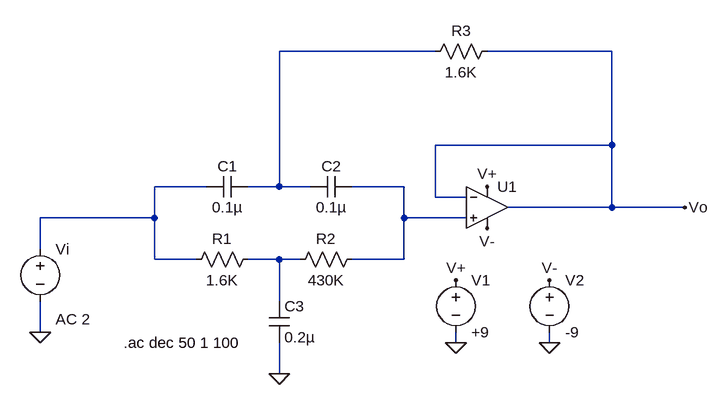
[diagram p0: schematic NOTCH.asc]
NOTCH.asc, the LTspice schematic file:
Version 4
SHEET 1 880 680
WIRE 288 -384 48 -384
WIRE 560 -384 368 -384
WIRE 560 -240 560 -384
WIRE 560 -240 288 -240
WIRE -64 -176 -144 -176
WIRE 48 -176 48 -384
WIRE 48 -176 0 -176
WIRE 96 -176 48 -176
WIRE 240 -176 160 -176
WIRE 288 -160 288 -240
WIRE 336 -160 288 -160
WIRE 560 -144 560 -240
WIRE 560 -144 400 -144
WIRE 672 -144 560 -144
WIRE -144 -128 -144 -176
WIRE -144 -128 -320 -128
WIRE 240 -128 240 -176
WIRE 336 -128 240 -128
WIRE -320 -80 -320 -128
WIRE -144 -64 -144 -128
WIRE -80 -64 -144 -64
WIRE 48 -64 0 -64
WIRE 80 -64 48 -64
WIRE 240 -64 240 -128
WIRE 240 -64 160 -64
WIRE 48 0 48 -64
WIRE -320 48 -320 0
WIRE 320 64 320 48
WIRE 464 64 464 48
WIRE 48 112 48 64
FLAG 48 112 0
FLAG -320 48 0
FLAG 320 -32 V+
FLAG 464 -32 V-
FLAG 320 64 0
FLAG 464 64 0
FLAG 368 -176 V+
FLAG 368 -112 V-
FLAG 672 -144 Vo
SYMBOL OpAmps\\UniversalOpAmp2 368 -144 R0
SYMATTR InstName U1
SYMBOL cap 160 -192 R90
WINDOW 0 0 32 VBottom 2
WINDOW 3 32 32 VTop 2
SYMATTR InstName C2
SYMATTR Value 0.1µ
SYMBOL cap 0 -192 R90
WINDOW 0 0 32 VBottom 2
WINDOW 3 32 32 VTop 2
SYMATTR InstName C1
SYMATTR Value 0.1µ
SYMBOL res 16 -80 R90
WINDOW 0 0 56 VBottom 2
WINDOW 3 32 56 VTop 2
SYMATTR InstName R1
SYMATTR Value 1.6K
SYMBOL res 176 -80 R90
WINDOW 0 0 56 VBottom 2
WINDOW 3 32 56 VTop 2
SYMATTR InstName R2
SYMATTR Value 430K
SYMBOL cap 32 0 R0
SYMATTR InstName C3
SYMATTR Value 0.2µ
SYMBOL res 384 -400 R90
WINDOW 0 0 56 VBottom 2
WINDOW 3 32 56 VTop 2
SYMATTR InstName R3
SYMATTR Value 1.6K
SYMBOL voltage -320 -96 R0
WINDOW 123 24 124 Left 2
WINDOW 39 0 0 Left 0
SYMATTR Value2 AC 2
SYMATTR InstName Vi
SYMATTR Value ""
SYMBOL voltage 320 -48 R0
SYMATTR InstName V1
SYMATTR Value +9
SYMBOL voltage 464 -48 R0
SYMATTR InstName V2
SYMATTR Value -9
TEXT -192 64 Left 2 !.ac dec 50 1 100

The netlist it stands for:
* NOTCH.asc
XU1 N003 Vo V+ V- Vo level2 Avol=1Meg GBW=10Meg Slew=10Meg Ilimit=25m Rail=0 Vos=0 En=0 Enk=0 In=0 Ink=0 Rin=500Meg  ; pins In+ In- V+ V- OUT
C2 N003 N001 0.1µ
C1 N001 N002 0.1µ
R1 N004 N002 1.6K
R2 N003 N004 430K
C3 N004 0 0.2µ
R3 Vo N001 1.6K
Vi N002 0 AC 2
V1 V+ 0 +9
V2 V- 0 -9
.ac dec 50 1 100
.lib UniversalOpAmp2.lib
.backanno
.end